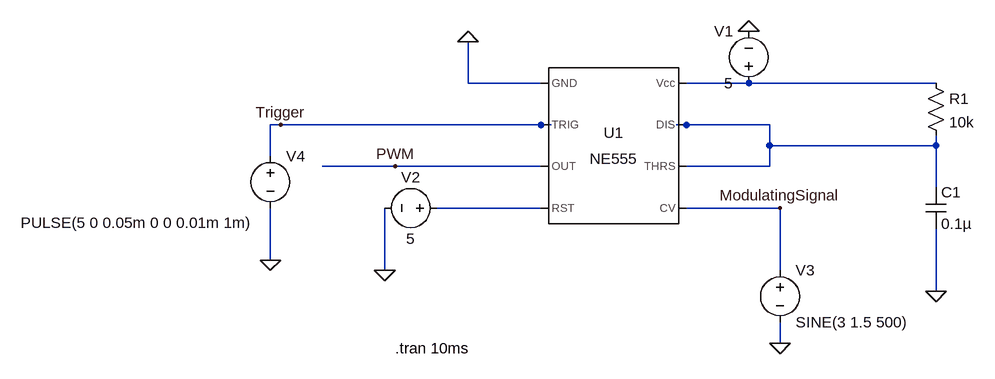
[diagram p0: schematic pwm_mod.asc]
pwm_mod.asc, the LTspice schematic file:
Version 4
SHEET 1 880 680
WIRE -16 96 -16 32
WIRE 96 96 -16 96
WIRE 416 96 320 96
WIRE 704 96 416 96
WIRE -304 160 -320 160
WIRE 96 160 -304 160
WIRE 112 160 96 160
WIRE 320 160 304 160
WIRE 448 160 320 160
WIRE 448 192 448 160
WIRE 704 192 704 176
WIRE 704 192 448 192
WIRE -320 208 -320 160
WIRE -128 224 -240 224
WIRE 96 224 -128 224
WIRE 448 224 448 192
WIRE 448 224 320 224
WIRE 704 256 704 192
WIRE 96 288 -64 288
WIRE 464 288 320 288
WIRE -320 368 -320 288
WIRE -144 384 -144 288
WIRE 464 384 464 288
WIRE 704 416 704 320
WIRE 464 496 464 464
FLAG 416 16 0
FLAG -16 32 0
FLAG -320 368 0
FLAG -144 384 0
FLAG 464 496 0
FLAG 704 416 0
FLAG -128 224 PWM
FLAG 464 288 ModulatingSignal
FLAG -304 160 Trigger
SYMBOL Misc\\NE555 208 192 R0
SYMATTR InstName U1
SYMBOL voltage 416 112 R180
WINDOW 0 24 96 Left 2
WINDOW 3 24 16 Left 2
WINDOW 123 0 0 Left 0
WINDOW 39 0 0 Left 0
SYMATTR InstName V1
SYMATTR Value 5
SYMBOL voltage -48 288 R90
WINDOW 0 -32 56 VBottom 2
WINDOW 3 32 56 VTop 2
WINDOW 123 0 0 Left 0
WINDOW 39 0 0 Left 0
SYMATTR InstName V2
SYMATTR Value 5
SYMBOL voltage 464 368 R0
WINDOW 123 0 0 Left 0
WINDOW 39 0 0 Left 0
SYMATTR InstName V3
SYMATTR Value SINE(3 1.5 500)
SYMBOL voltage -320 192 R0
WINDOW 3 -384 119 Left 2
WINDOW 123 0 0 Left 0
WINDOW 39 0 0 Left 0
SYMATTR Value PULSE(5 0 0.05m 0 0 0.01m 1m)
SYMATTR InstName V4
SYMBOL cap 688 256 R0
SYMATTR InstName C1
SYMATTR Value 0.1µ
SYMBOL res 688 80 R0
SYMATTR InstName R1
SYMATTR Value 10k
TEXT -128 504 Left 2 !.tran 10ms

The netlist it stands for:
* pwm_mod.asc
XU1 0 Trigger PWM N003 ModulatingSignal N002 N002 N001 NE555  ; pins GND TRIG OUT RST CV THRS DIS Vcc
V1 N001 0 5
V2 N003 0 5
V3 ModulatingSignal 0 SINE(3 1.5 500)
V4 Trigger 0 PULSE(5 0 0.05m 0 0 0.01m 1m)
C1 N002 0 0.1µ
R1 N001 N002 10k
.tran 10ms
.lib NE555.sub
.backanno
.end